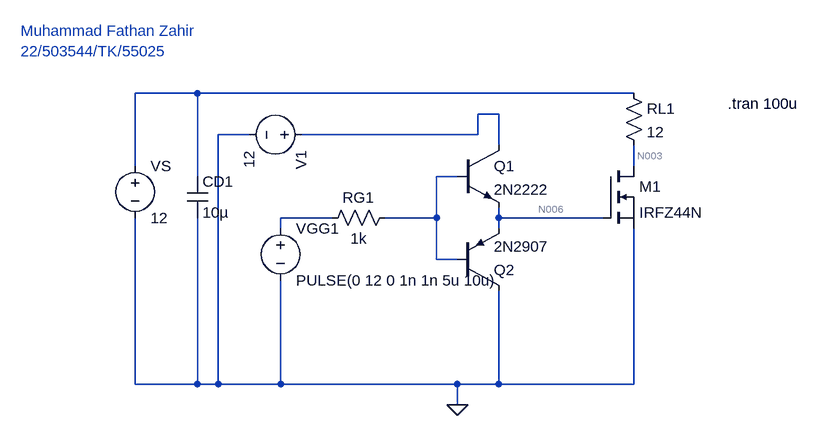
[diagram p0: schematic circuit2.asc]
circuit2.asc, the LTspice schematic file:
Version 4.1
SHEET 1 880 680
WIRE -384 -64 -480 -64
WIRE 288 -64 -384 -64
WIRE 80 -32 48 -32
WIRE -304 0 -352 0
WIRE 48 0 48 -32
WIRE 48 0 -224 0
WIRE 80 16 80 -32
WIRE -480 48 -480 -64
WIRE 288 48 288 16
WIRE -384 64 -384 -64
WIRE 16 64 -16 64
WIRE -176 128 -256 128
WIRE -16 128 -16 64
WIRE -16 128 -96 128
WIRE 80 128 80 112
WIRE 240 128 80 128
WIRE -256 144 -256 128
WIRE 80 144 80 128
WIRE -16 192 -16 128
WIRE 16 192 -16 192
WIRE -480 384 -480 128
WIRE -384 384 -384 128
WIRE -384 384 -480 384
WIRE -352 384 -352 0
WIRE -352 384 -384 384
WIRE -256 384 -256 224
WIRE -256 384 -352 384
WIRE 16 384 -256 384
WIRE 80 384 80 240
WIRE 80 384 16 384
WIRE 288 384 288 144
WIRE 288 384 80 384
WIRE 16 416 16 384
FLAG 16 416 0
SYMBOL cap -400 64 R0
SYMATTR InstName CD1
SYMATTR Value 10µ
SYMBOL res 272 -80 R0
SYMATTR InstName RL1
SYMATTR Value 12
SYMBOL nmos 240 48 R0
SYMATTR InstName M1
SYMATTR Value IRFZ44N
SYMBOL res -80 112 R90
WINDOW 0 0 56 VBottom 2
WINDOW 3 32 56 VTop 2
SYMATTR InstName RG1
SYMATTR Value 1k
SYMBOL voltage -256 128 R0
WINDOW 123 0 0 Left 0
WINDOW 39 0 0 Left 0
SYMATTR InstName VGG1
SYMATTR Value PULSE(0 12 0 1n 1n 5u 10u)
SYMBOL voltage -480 32 R0
WINDOW 123 0 0 Left 0
WINDOW 39 0 0 Left 0
SYMATTR InstName VS
SYMATTR Value 12
SYMBOL npn 16 16 R0
SYMATTR InstName Q1
SYMATTR Value 2N2222
SYMBOL pnp 16 240 M180
SYMATTR InstName Q2
SYMATTR Value 2N2907
SYMBOL voltage -208 0 R90
WINDOW 123 0 0 Left 0
WINDOW 39 0 0 Left 0
SYMATTR InstName V1
SYMATTR Value 12
TEXT 432 -48 Left 2 !.tran 100u
TEXT -656 -160 Left 2 ;Muhammad Fathan Zahir\n22/503544/TK/55025

The netlist it stands for:
* circuit2.asc
CD1 N001 0 10µ
RL1 N001 N003 12
M1 N003 N006 0 0 IRFZ44N
RG1 N004 N005 1k
VGG1 N005 0 PULSE(0 12 0 1n 1n 5u 10u)
VS N001 0 12
Q1 N002 N004 N006 0 2N2222
Q2 0 N004 N006 0 2N2907
V1 N002 0 12
.model NPN NPN
.model PNP PNP
.lib standard.bjt
.model NMOS NMOS
.model PMOS PMOS
.lib standard.mos
.tran 100u
* Muhammad Fathan Zahir
* 22/503544/TK/55025
.backanno
.end

* Results of the author's LTspice run, read from the files saved beside the schematic
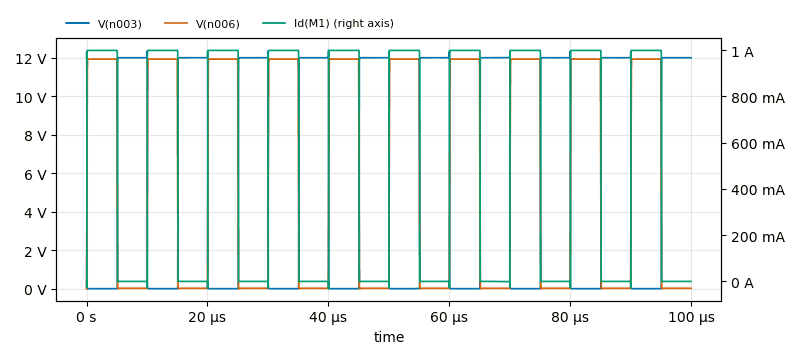
[diagram p1: Transient Analysis of circuit2.asc, plotted from the saved traces]
* Transient Analysis, 1 run:
*   V(n003): min 10.73 mV, max 12.38 V, average 5.934 V, rms 8.425 V, last 12 V
*   V(n006): min 3.968 mV, max 11.94 V, average 5.981 V, rms 8.399 V, last 31.3 mV
*   Id(M1): min -31.87 mA, max 999.1 mA, average 505.5 mA, rms 709.9 mA, last 31.8 µA